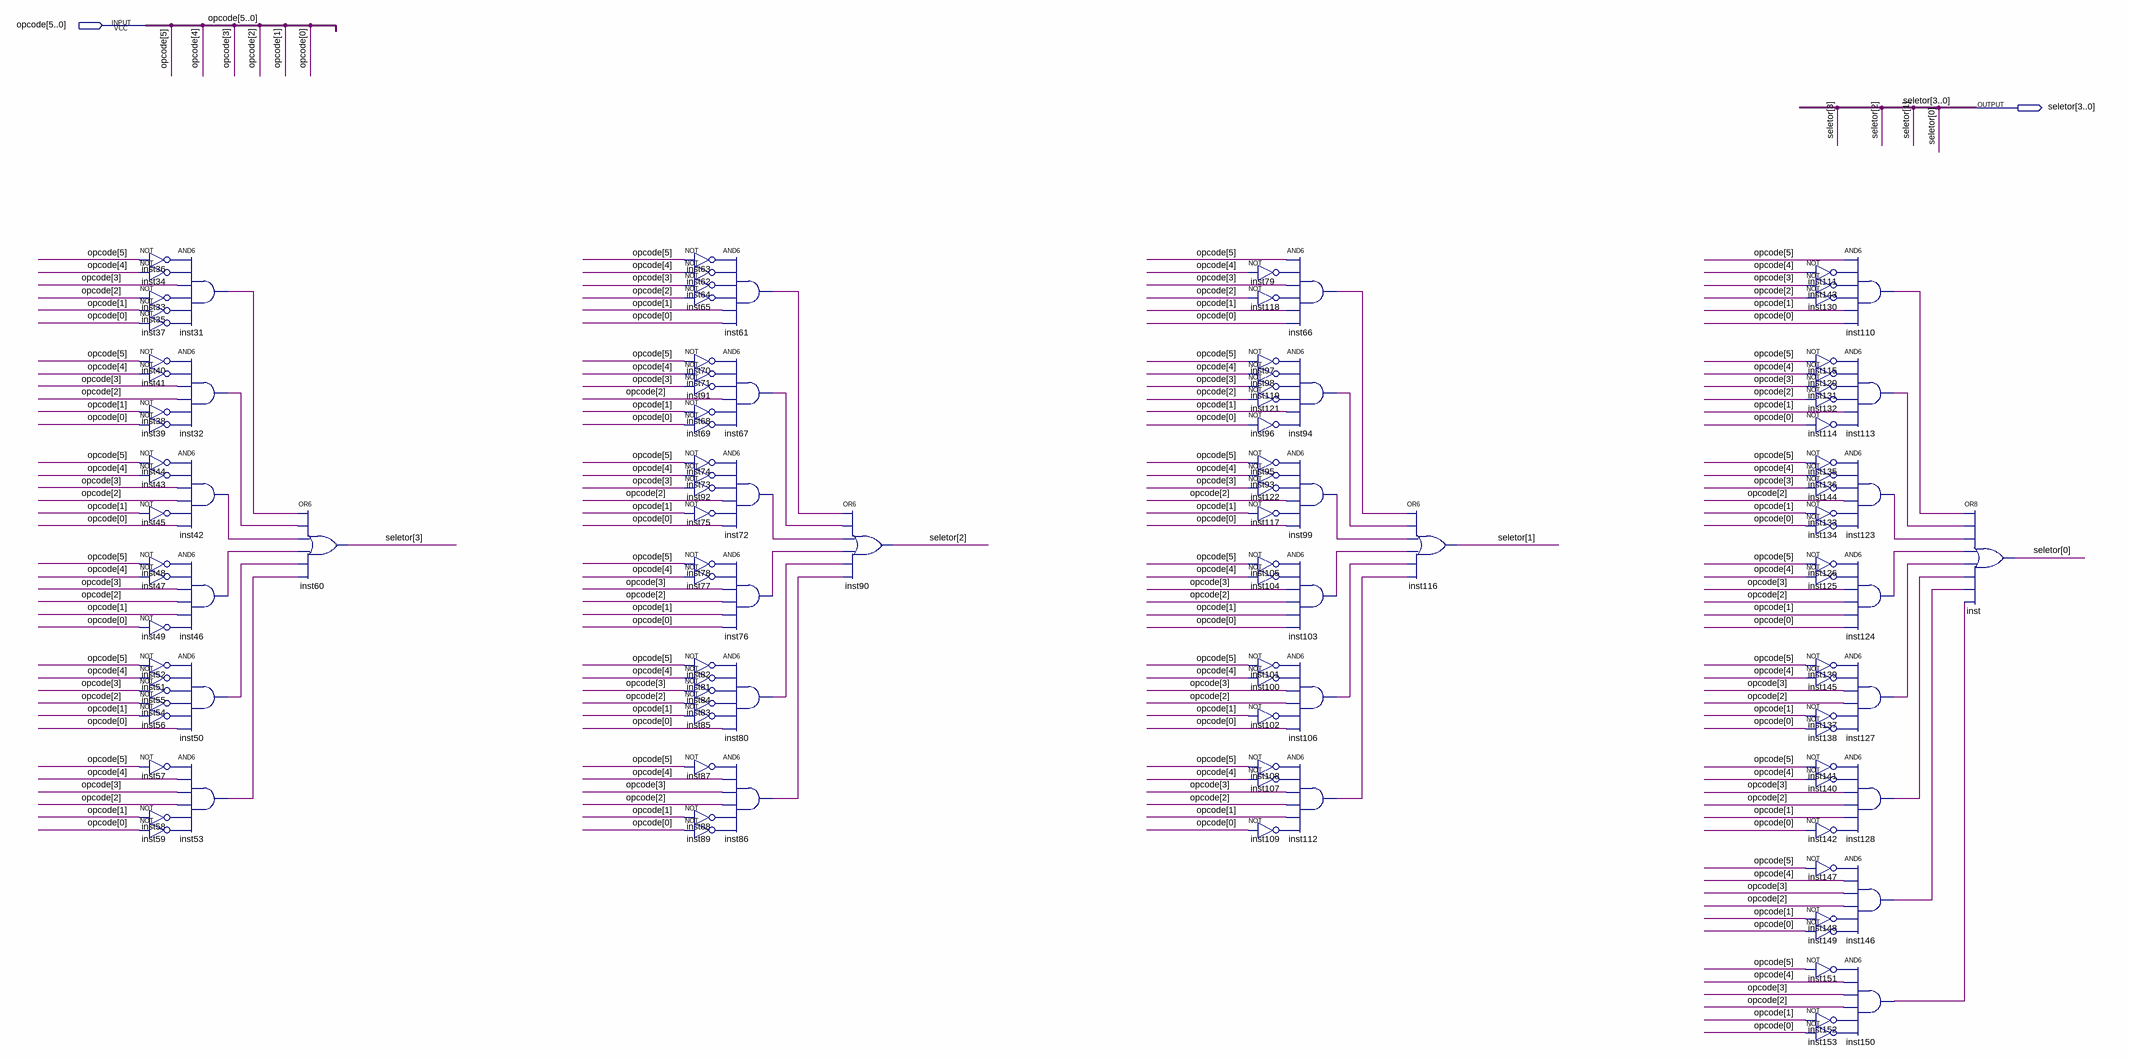
[diagram p0: schematic sheet]
// Quartus schematic controle_coder.bdf as structural Verilog: 123 symbols, 2 pins
module controle_coder (
  input  [5:0] opcode,
  output [3:0] seletor
);

  wire inst31_out, inst32_out, inst33_out, inst34_out, inst35_out, inst36_out, inst37_out, inst38_out,
       inst39_out, inst40_out, inst41_out, inst42_out, inst43_out, inst44_out, inst45_out, inst46_out,
       inst47_out, inst48_out, inst49_out, inst50_out, inst51_out, inst52_out, inst53_out, inst54_out,
       inst55_out, inst56_out, inst57_out, inst58_out, inst59_out, inst61_out, inst62_out, inst63_out,
       inst64_out, inst65_out, inst66_out, inst67_out, inst68_out, inst69_out, inst70_out, inst71_out,
       inst72_out, inst73_out, inst74_out, inst75_out, inst76_out, inst77_out, inst78_out, inst79_out,
       inst80_out, inst81_out, inst82_out, inst83_out, inst84_out, inst85_out, inst86_out, inst87_out,
       inst88_out, inst89_out, inst91_out, inst92_out, inst93_out, inst94_out, inst95_out, inst96_out,
       inst97_out, inst98_out, inst99_out, inst100_out, inst101_out, inst102_out, inst103_out, inst104_out,
       inst105_out, inst106_out, inst107_out, inst108_out, inst109_out, inst110_out, inst111_out,
       inst112_out, inst113_out, inst114_out, inst115_out, inst117_out, inst118_out, inst119_out,
       inst120_out, inst121_out, inst122_out, inst123_out, inst124_out, inst125_out, inst126_out,
       inst127_out, inst128_out, inst130_out, inst131_out, inst132_out, inst133_out, inst134_out,
       inst135_out, inst136_out, inst137_out, inst138_out, inst139_out, inst140_out, inst141_out,
       inst142_out, inst143_out, inst144_out, inst145_out, inst146_out, inst147_out, inst148_out,
       inst149_out, inst150_out, inst151_out, inst152_out, inst153_out;

  and inst31 (inst31_out, inst36_out, inst34_out, opcode[3], inst33_out, inst35_out, inst37_out);
  not inst36 (inst36_out, opcode[5]);
  not inst34 (inst34_out, opcode[4]);
  not inst33 (inst33_out, opcode[2]);
  not inst35 (inst35_out, opcode[1]);
  not inst37 (inst37_out, opcode[0]);
  and inst32 (inst32_out, inst40_out, inst41_out, opcode[3], opcode[2], inst38_out, inst39_out);
  not inst40 (inst40_out, opcode[5]);
  not inst41 (inst41_out, opcode[4]);
  not inst38 (inst38_out, opcode[1]);
  not inst39 (inst39_out, opcode[0]);
  and inst42 (inst42_out, inst44_out, inst43_out, opcode[3], opcode[2], inst45_out, opcode[0]);
  not inst44 (inst44_out, opcode[5]);
  not inst43 (inst43_out, opcode[4]);
  not inst45 (inst45_out, opcode[1]);
  and inst46 (inst46_out, inst48_out, inst47_out, opcode[3], opcode[2], opcode[1], inst49_out);
  not inst48 (inst48_out, opcode[5]);
  not inst47 (inst47_out, opcode[4]);
  not inst49 (inst49_out, opcode[0]);
  and inst50 (inst50_out, inst52_out, inst51_out, inst55_out, inst54_out, inst56_out, opcode[0]);
  not inst52 (inst52_out, opcode[5]);
  not inst51 (inst51_out, opcode[4]);
  not inst55 (inst55_out, opcode[3]);
  not inst54 (inst54_out, opcode[2]);
  not inst56 (inst56_out, opcode[1]);
  and inst53 (inst53_out, inst57_out, opcode[4], opcode[3], opcode[2], inst58_out, inst59_out);
  not inst57 (inst57_out, opcode[5]);
  not inst58 (inst58_out, opcode[1]);
  not inst59 (inst59_out, opcode[0]);
  or inst60 (seletor[3], inst31_out, inst32_out, inst42_out, inst46_out, inst50_out, inst53_out);
  not inst63 (inst63_out, opcode[5]);
  not inst62 (inst62_out, opcode[4]);
  not inst64 (inst64_out, opcode[3]);
  not inst65 (inst65_out, opcode[2]);
  not inst70 (inst70_out, opcode[5]);
  not inst71 (inst71_out, opcode[4]);
  not inst91 (inst91_out, opcode[3]);
  not inst68 (inst68_out, opcode[1]);
  not inst69 (inst69_out, opcode[0]);
  not inst74 (inst74_out, opcode[5]);
  not inst73 (inst73_out, opcode[4]);
  not inst92 (inst92_out, opcode[3]);
  not inst75 (inst75_out, opcode[1]);
  not inst78 (inst78_out, opcode[5]);
  not inst77 (inst77_out, opcode[4]);
  not inst82 (inst82_out, opcode[5]);
  not inst81 (inst81_out, opcode[4]);
  not inst84 (inst84_out, opcode[3]);
  not inst83 (inst83_out, opcode[2]);
  not inst85 (inst85_out, opcode[1]);
  not inst87 (inst87_out, opcode[5]);
  not inst88 (inst88_out, opcode[1]);
  not inst89 (inst89_out, opcode[0]);
  and inst61 (inst61_out, inst63_out, inst62_out, inst64_out, inst65_out, opcode[1], opcode[0]);
  and inst67 (inst67_out, inst70_out, inst71_out, inst91_out, opcode[2], inst68_out, inst69_out);
  and inst72 (inst72_out, inst74_out, inst73_out, inst92_out, opcode[2], inst75_out, opcode[0]);
  and inst76 (inst76_out, inst78_out, inst77_out, opcode[3], opcode[2], opcode[1], opcode[0]);
  and inst80 (inst80_out, inst82_out, inst81_out, inst84_out, inst83_out, inst85_out, opcode[0]);
  and inst86 (inst86_out, inst87_out, opcode[4], opcode[3], opcode[2], inst88_out, inst89_out);
  or inst90 (seletor[2], inst61_out, inst67_out, inst72_out, inst76_out, inst80_out, inst86_out);
  not inst79 (inst79_out, opcode[4]);
  not inst118 (inst118_out, opcode[2]);
  not inst97 (inst97_out, opcode[5]);
  not inst98 (inst98_out, opcode[4]);
  not inst119 (inst119_out, opcode[3]);
  not inst121 (inst121_out, opcode[2]);
  not inst96 (inst96_out, opcode[0]);
  not inst95 (inst95_out, opcode[5]);
  not inst93 (inst93_out, opcode[4]);
  not inst122 (inst122_out, opcode[3]);
  not inst117 (inst117_out, opcode[1]);
  not inst105 (inst105_out, opcode[5]);
  not inst104 (inst104_out, opcode[4]);
  not inst101 (inst101_out, opcode[5]);
  not inst100 (inst100_out, opcode[4]);
  not inst102 (inst102_out, opcode[1]);
  not inst108 (inst108_out, opcode[5]);
  not inst107 (inst107_out, opcode[4]);
  not inst109 (inst109_out, opcode[0]);
  and inst66 (inst66_out, opcode[5], inst79_out, opcode[3], inst118_out, opcode[1], opcode[0]);
  and inst94 (inst94_out, inst97_out, inst98_out, inst119_out, inst121_out, opcode[1], inst96_out);
  and inst99 (inst99_out, inst95_out, inst93_out, inst122_out, opcode[2], inst117_out, opcode[0]);
  and inst103 (inst103_out, inst105_out, inst104_out, opcode[3], opcode[2], opcode[1], opcode[0]);
  and inst106 (inst106_out, inst101_out, inst100_out, opcode[3], opcode[2], inst102_out, opcode[0]);
  and inst112 (inst112_out, inst108_out, inst107_out, opcode[3], opcode[2], opcode[1], inst109_out);
  or inst116 (seletor[1], inst66_out, inst94_out, inst99_out, inst103_out, inst106_out, inst112_out);
  not inst111 (inst111_out, opcode[4]);
  not inst143 (inst143_out, opcode[3]);
  not inst130 (inst130_out, opcode[2]);
  not inst115 (inst115_out, opcode[5]);
  not inst120 (inst120_out, opcode[4]);
  not inst131 (inst131_out, opcode[3]);
  not inst132 (inst132_out, opcode[2]);
  not inst114 (inst114_out, opcode[0]);
  not inst135 (inst135_out, opcode[5]);
  not inst136 (inst136_out, opcode[4]);
  not inst144 (inst144_out, opcode[3]);
  not inst133 (inst133_out, opcode[1]);
  not inst134 (inst134_out, opcode[0]);
  not inst126 (inst126_out, opcode[5]);
  not inst125 (inst125_out, opcode[4]);
  not inst139 (inst139_out, opcode[5]);
  not inst145 (inst145_out, opcode[4]);
  not inst137 (inst137_out, opcode[1]);
  not inst138 (inst138_out, opcode[0]);
  not inst141 (inst141_out, opcode[5]);
  not inst140 (inst140_out, opcode[4]);
  not inst142 (inst142_out, opcode[0]);
  not inst147 (inst147_out, opcode[5]);
  not inst148 (inst148_out, opcode[1]);
  not inst149 (inst149_out, opcode[0]);
  not inst151 (inst151_out, opcode[5]);
  not inst152 (inst152_out, opcode[1]);
  not inst153 (inst153_out, opcode[0]);
  and inst110 (inst110_out, opcode[5], inst111_out, inst143_out, inst130_out, opcode[1], opcode[0]);
  and inst113 (inst113_out, inst115_out, inst120_out, inst131_out, inst132_out, opcode[1], inst114_out);
  and inst123 (inst123_out, inst135_out, inst136_out, inst144_out, opcode[2], inst133_out, inst134_out);
  and inst124 (inst124_out, inst126_out, inst125_out, opcode[3], opcode[2], opcode[1], opcode[0]);
  and inst127 (inst127_out, inst139_out, inst145_out, opcode[3], opcode[2], inst137_out, inst138_out);
  and inst128 (inst128_out, inst141_out, inst140_out, opcode[3], opcode[2], opcode[1], inst142_out);
  and inst146 (inst146_out, inst147_out, opcode[4], opcode[3], opcode[2], inst148_out, inst149_out);
  and inst150 (inst150_out, inst151_out, opcode[4], opcode[3], opcode[2], inst152_out, inst153_out);
  or inst (seletor[0], inst110_out, inst113_out, inst123_out, inst124_out, inst127_out, inst128_out, inst146_out, inst150_out);
endmodule
